# EAGLE design LilypadShield(wPower) (EAGLE 6.4)
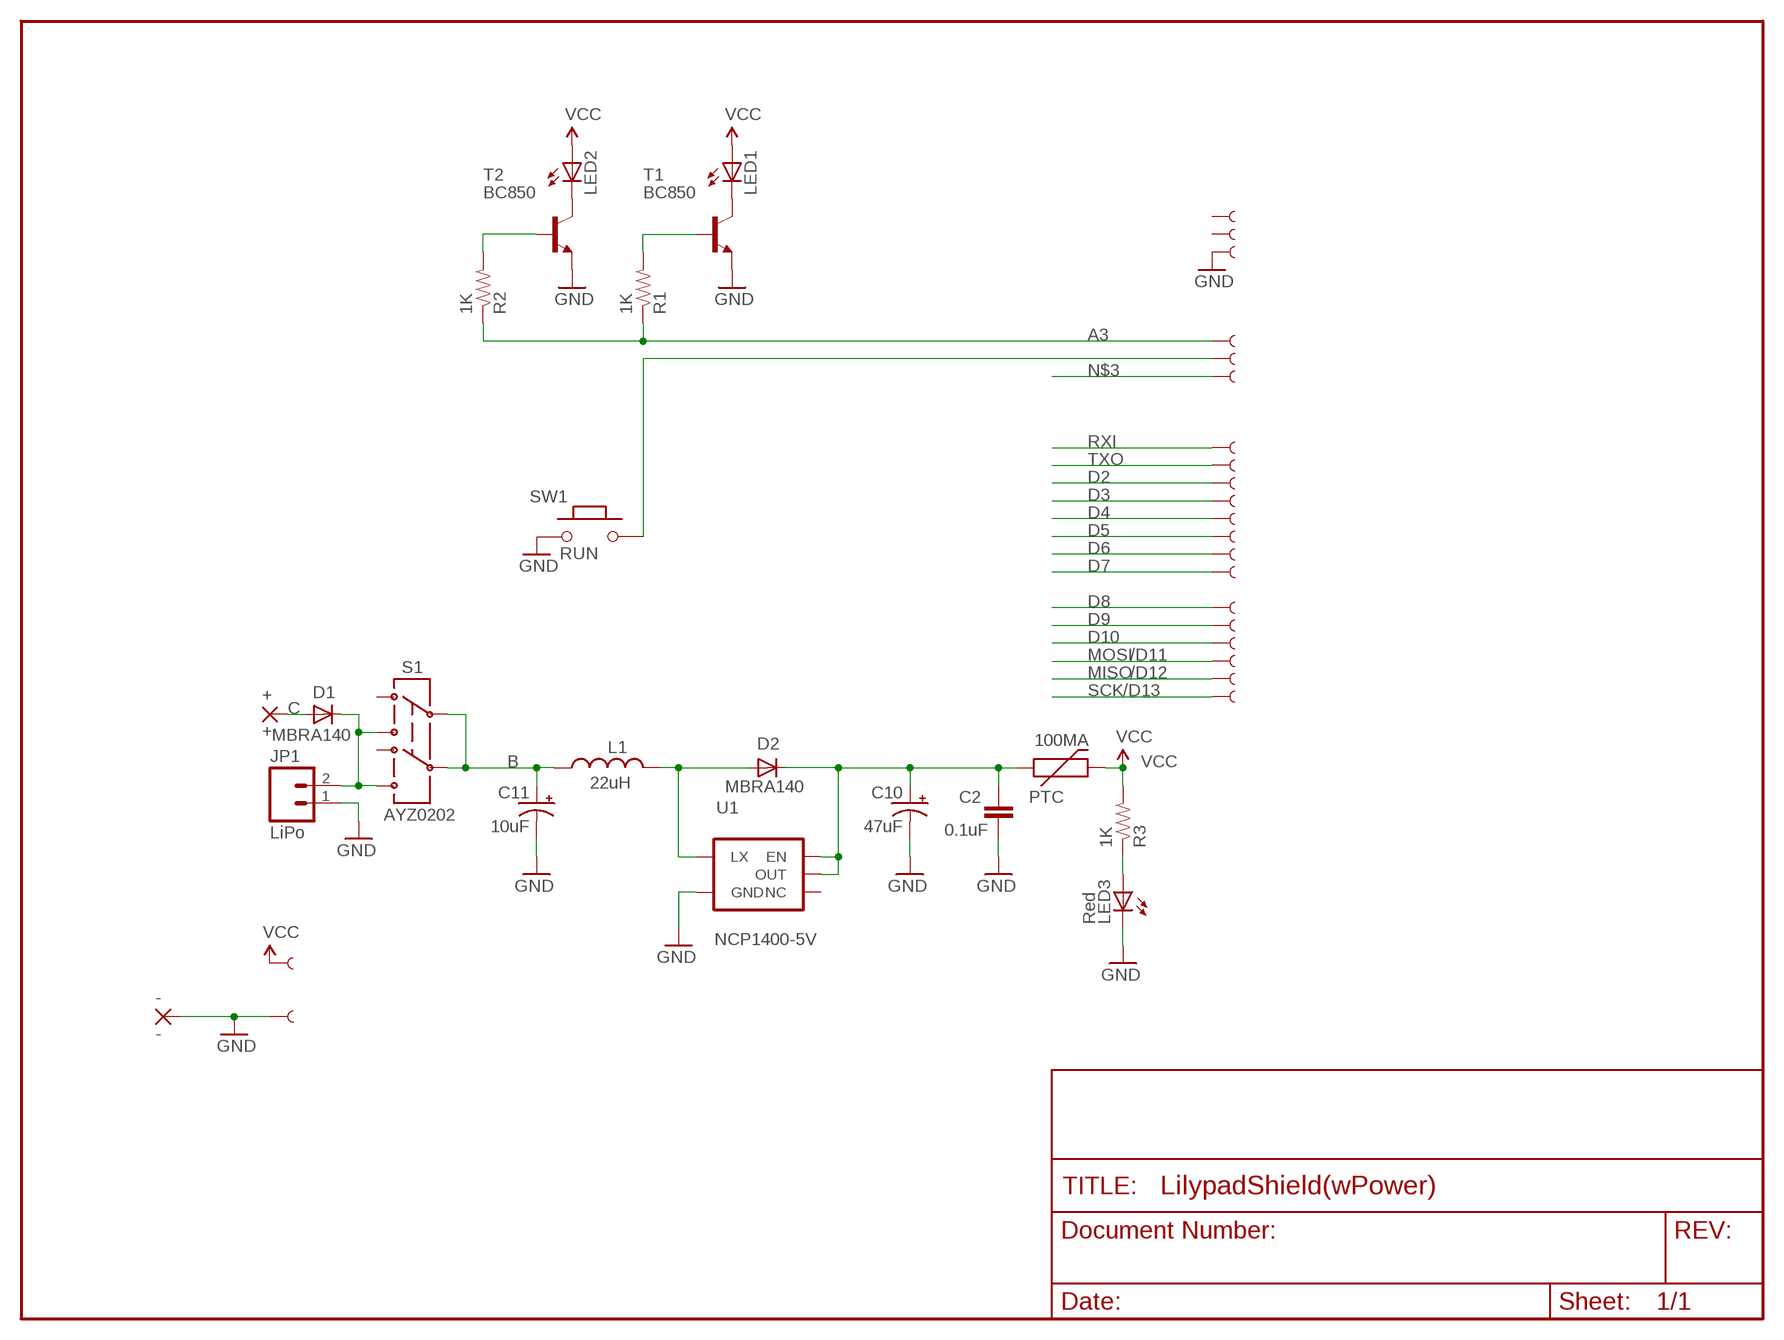
[diagram p0: schematic, sheet 1]

## Parts
100MA  PTC  PTCSMD  [PTC-1206]
+  +  1,6/0,8  [1,6/0,8]
-  -  1,6/0,8  [1,6/0,8]
C2  0.1uF  CAP0603-CAP  [0603-CAP]
C10  47uF  CAP_POL2  [EIA3528-21]
C11  10uF  CAP_POL1206  [CPOL_1206]
D1  MBRA140  DIODESMA  [SMA-DIODE]
D2  MBRA140  DIODESMA  [SMA-DIODE]
GND  SEWTAP1  [SEWTAP]
JP1  LiPo  M02-JST-2MM-SMT  [JST-2-SMD]
L1  22uH  INDUCTORCR54  [CR54]
LED1  LED5MM  [LED5MM]
LED2  LED5MM  [LED5MM]
LED3  Red  LED1206  [LED-1206]
R1  1K  RESISTOR0603-RES  [0603-RES]
R2  1K  RESISTOR0603-RES  [0603-RES]
R3  1K  RESISTOR0603-RES  [0603-RES]
S1  AYZ0202  [AYZ0202]
SW1  RUN  PB157  [157SW]
T1  BC850  [SOT23]
T2  BC850  [SOT23]
U1  NCP1400-5V  V_REG_NCP1400SOT23-5  [SOT23-5]
U$4  SEWTAP1  [SEWTAP]
U$30  SEWTAP1  [SEWTAP]
U$31  SEWTAP1  [SEWTAP]
U$32  SEWTAP1  [SEWTAP]
U$33  SEWTAP1  [SEWTAP]
U$34  SEWTAP1  [SEWTAP]
U$35  SEWTAP1  [SEWTAP]
U$36  SEWTAP1  [SEWTAP]
U$37  SEWTAP1  [SEWTAP]
U$38  SEWTAP1  [SEWTAP]
U$39  SEWTAP1  [SEWTAP]
U$40  SEWTAP1  [SEWTAP]
U$41  SEWTAP1  [SEWTAP]
U$42  SEWTAP1  [SEWTAP]
U$43  SEWTAP1  [SEWTAP]
U$44  SEWTAP1  [SEWTAP]
U$45  SEWTAP1  [SEWTAP]
U$46  SEWTAP1  [SEWTAP]
U$47  SEWTAP1  [SEWTAP]
U$48  SEWTAP1  [SEWTAP]
U$51  SEWTAP1  [SEWTAP]

## Nets
A3: R1.1 R2.1 U$32.1
B: C11.A(+) L1.P$2 S1.2 S1.5
C: +.1(P) D1.A
D2: U$45.1
D3: U$44.1
D4: U$43.1
D5: U$42.1
D6: U$41.1
D7: U$48.1
D8: U$35.1
D9: U$36.1
D10: U$37.1
GND: -.1(P) C2.2 C10.C(-) C11.C(-) JP1.1 LED3.C SW1.1 T1.2(E) T2.2(E) U1.4(GND) U$30.1 U$31.1
MISO: U$39.1
MOSI: U$38.1
N$1: LED2.K(C) T2.3(C)
N$2: LED1.K(C) T1.3(C)
N$3: U$34.1
N$4: R2.2 T2.1(B)
N$5: R1.2 T1.1(B)
N$7: SW1.2 U$33.1
N$9: LED3.A R3.1
N$12: 100MA.1 C2.1 C10.A(+) D2.C U1.1(EN) U1.2(OUT)
N$13: D1.C JP1.2 S1.1 S1.4
N$16: D2.A L1.P$1 U1.5(LX)
RXI: U$47.1
SCK: U$40.1
TXO: U$46.1
VCC: 100MA.2 LED1.A LED2.A R3.2 U$4.1
Unconnected: GND.1 S1.3 S1.6 U1.3(NC) U$51.1

## Notes on the sheet
- /D11
- /D12
- /D13

## Library data of the parts
100MA = SparkFun:PTC: Resettable Fuse PTC Resettable Fuse. Spark Fun Electronics SKU : COM-08357
+ - = wirepad:1,6/0,8: THROUGH-HOLE PAD
C2 = SparkFun:CAP: Capacitor Standard 0603 ceramic capacitor, and 0.1" leaded capacitor.
C10 C11 = SparkFun-Nate:CAP_POL
D1 D2 = SparkFun-Nate:DIODE
GND U$4 U$30-U$48 U$51 = LilyPad-Wearables:SEWTAP
JP1 = SparkFun:M02: Header 2 Standard 2-pin 0.1" header. Use with straight break away headers (SKU : PRT-00116), right angle break away headers (PRT-00553), swiss pins (PRT-00743), machine pins (PRT-00117), and female headers (PRT-00115). Molex polarized connector foot print use with SKU : PRT-08233 with associated crimp pins and housings.
L1 = SparkFun-Nate:INDUCTOR: Basic Inductor/Choke - 0603 and 1206
LED1 LED2 = led:LED: LED OSRAM: - CHIPLED LG R971, LG N971, LY N971, LG Q971, LY Q971, LO R971, LY R971 LH N974, LH R974 LS Q976, LO Q976, LY Q976 LO Q996 - Hyper CHIPLED LW Q18S LB Q993, LB Q99A, LB R99A - SideLED LS A670, LO A670, LY A670, LG A670, LP A670 LB A673, LV A673, LT A673, LW A673 LH A674 LY A675 LS A676, LA A676, LO A676, LY A676, LW A676 LS A679, LY A679, LG A679 - Hyper Micro SIDELED® LS Y876, LA Y876, LO Y876, LY Y876 LT Y87S - SmartLED LW L88C, LW L88S LB L89C, LB L89S, LG L890 LS L89K, LO L89K, LY L89K LS L896, LA L896, LO L896, LY L896 - TOPLED LS T670, LO T670, LY T670, LG T670, LP T670 LSG T670, LSP T670, LSY T670, LOP T670, LYG T670 LG T671, LOG T671, LSG T671 LB T673, LV T673, LT T673, LW T673 LH T674 LS T676, LA T676, LO T676, LY T676, LB T676, LH T676, LSB T676, LW T676 LB T67C, LV T67C, LT T67C, LS T67K, LO T67K, LY T67K, LW E67C LS E67B, LA E67B, LO E67B, LY E67B, LB E67C, LV E67C, LT E67C LW T67C LS T679, LY T679, LG T679 LS T770, LO T770, LY T770, LG T770, LP T770 LB T773, LV T773, LT T773, LW T773 LH T774 LS E675, LA E675, LY E675, LS T675 LS T776, LA T776, LO T776, LY T776, LB T776 LHGB T686 LT T68C, LB T68C - Hyper Mini TOPLED® LB M676 - Mini TOPLED Santana® LG M470 LS M47K, LO M47K, LY M47K Source: http://www.osram.convergy.de LUXEON: - LUMILED® LXK2-PW12-R00, LXK2-PW12-S00, LXK2-PW14-U00, LXK2-PW14-V00 LXK2-PM12-R00, LXK2-PM12-S00, LXK2-PM14-U00 LXK2-PE12-Q00, LXK2-PE12-R00, LXK2-PE12-S00, LXK2-PE14-T00, LXK2-PE14-U00 LXK2-PB12-K00, LXK2-PB12-L00, LXK2-PB12-M00, LXK2-PB14-N00, LXK2-PB14-P00, LXK2-PB14-Q00 LXK2-PR12-L00, LXK2-PR12-M00, LXK2-PR14-Q00, LXK2-PR14-R00 LXK2-PD12-Q00, LXK2-PD12-R00, LXK2-PD12-S00 LXK2-PH12-R00, LXK2-PH12-S00 LXK2-PL12-P00, LXK2-PL12-Q00, LXK2-PL12-R00 Source: www.luxeon.com KINGBRIGHT: KA-3528ASYC Source: www.kingbright.com
LED3 = SparkFun:LED: LEDs Standard schematic elements and footprints for 5mm, 3mm, 1206, and 0603 sized LEDs. 5mm - Spark Fun Electronics SKU : COM-00529 (and others)
R1-R3 = SparkFun:RESISTOR: Resistor Basic schematic elements and footprints for 0603, 1206, and PTH resistors.
S1 = SparkFun:AYZ0202: SPDT Slide Switch Simple SMD single-pull double-throw slide switch. Good for less than 350mA power switch, switching UARTs between devices, etc. Spark Fun Electronics SKU : COM-00597
SW1 = MySMD:PB157
T1 T2 = transistor-neu-to92:BC850: NPN TRANSISTOR
U1 = SparkFun:V_REG_NCP1400: Switching step-up voltage regulator NCP1400 switiching regulator takes single cell AA and outputs 100mA at 3.3V or 5V with minimal number of external components.

## Net classes
0 Default: width 0.203 mm, clearance 0.355 mm
1 VCC: width 0.305 mm, clearance 0.355 mm

## Board
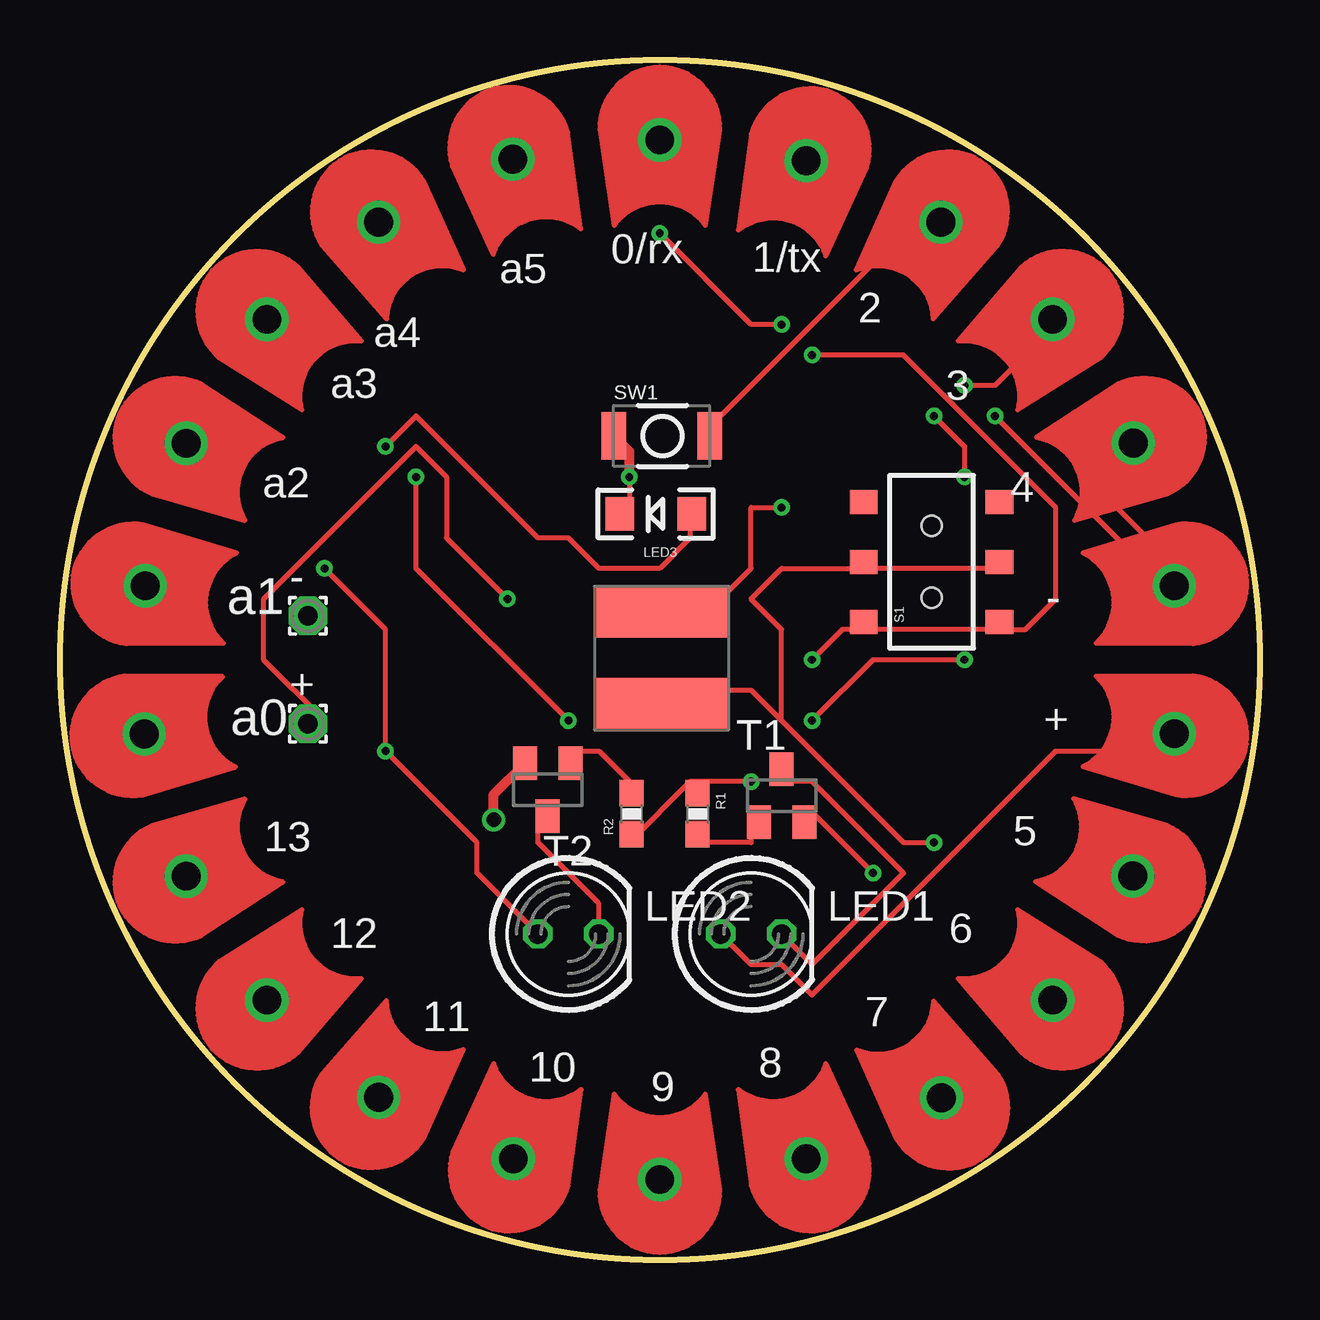
[diagram p1: board, top side]
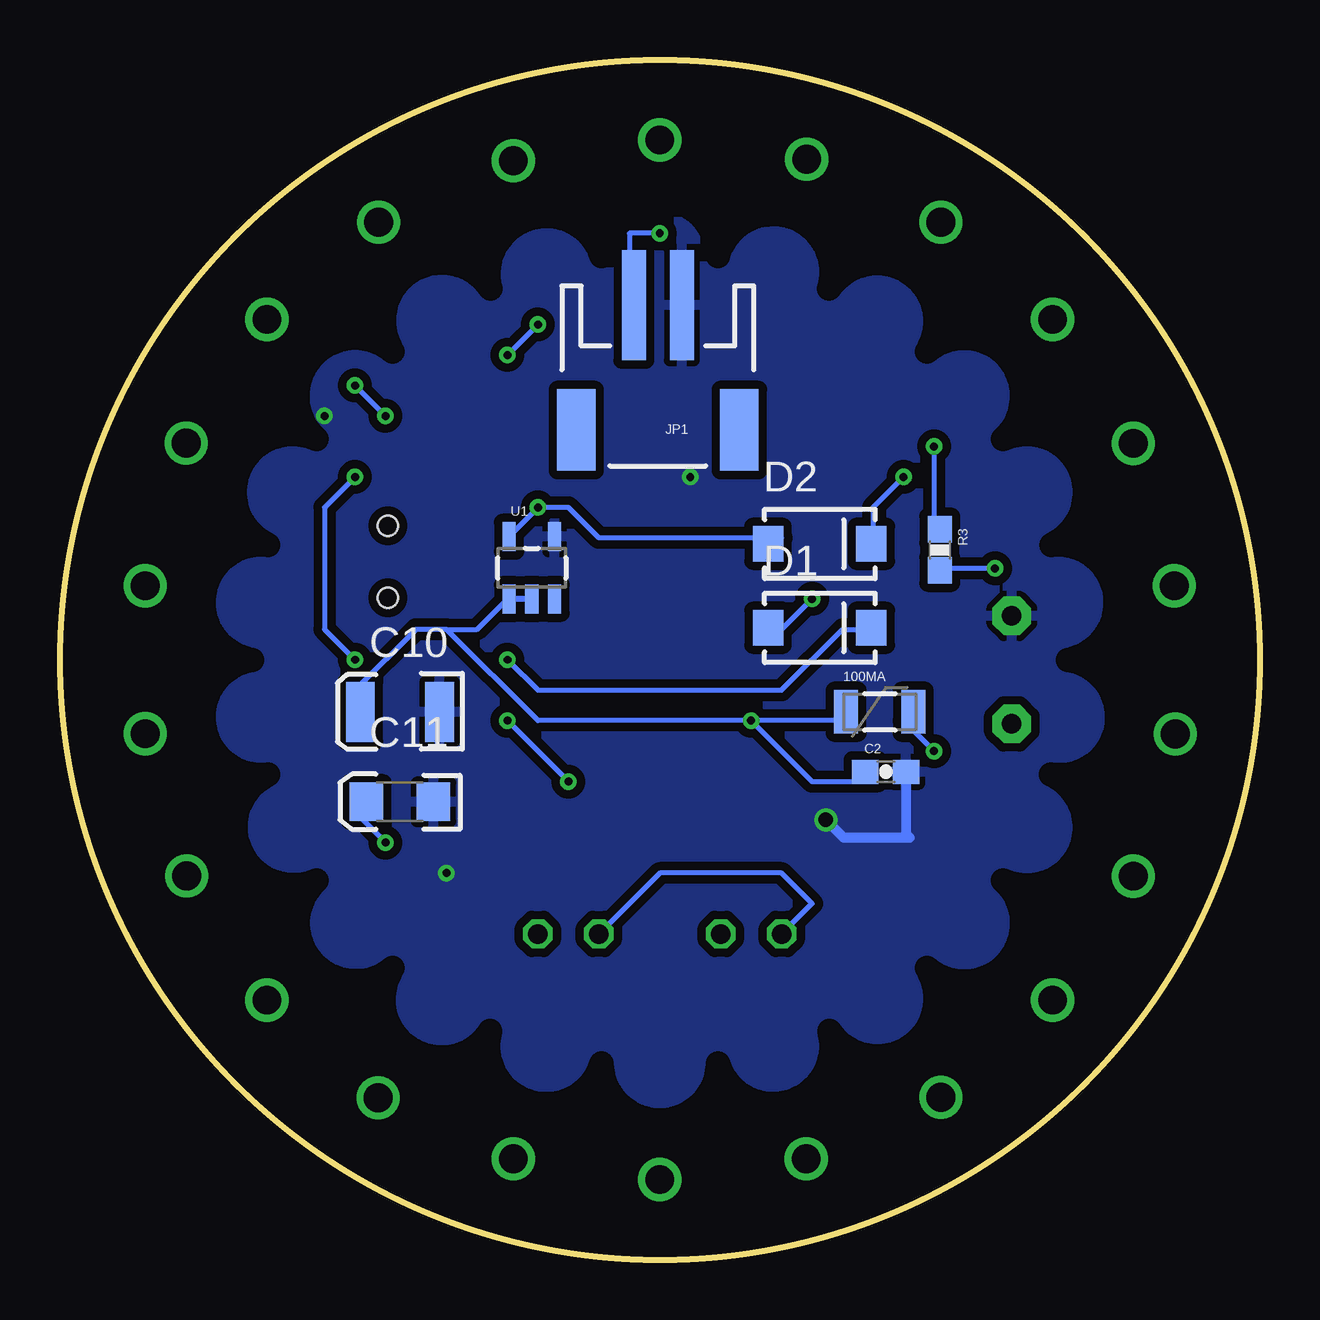
[diagram p2: board, bottom side, seen from below]

Size 50 x 50 mm. Coordinates in mm from the lower left corner, seen from the top.
Outline: circle at 25,25 radius 25
Copper layers (1*16): Top 0.0356mm / dielectric 1.5011mm / Bottom 0.0356mm
Design rules "LaenPCBOrder": minimum track width 6mil, minimum drill 13mil, track to track 6mil, track to pad 6mil, pad to pad 6mil, via to via 6mil, smd to smd 6mil, copper to edge 15mil, drill to drill 6mil, minimum pad ring 7mil, minimum via ring 7mil, stop-mask expansion 3mil, vias tented up to drill 0mil, thermal gap 10mil
bRestrict: area 2.4,2.4 to 47.6,47.6; area 21,42.8 to 23.5,44; area 31.6,41.3 to 34.4,43; area 36.3,38.4 to 38.9,40.7; area 40,34.1 to 42,36.9; area 42.2,29.2 to 43.6,31.8; area 42.8,23.9 to 44,26.2; area 42.2,18.2 to 43.7,20.9; area 36.3,9.4 to 39,11.7; area 31.7,7 to 34.5,8.7; area 26.5,6 to 28.9,7.3; area 21.1,6 to 23.6,7.3; area 15.6,7 to 18.3,8.7; area 11,9.3 to 13.8,11.6; area 8,13.1 to 10.1,15.9; area 6.4,18.2 to 8,20.8; area 6,23.7 to 7.2,26.2; area 6.3,29.1 to 7.9,31.7; area 8,34 to 10.1,36.9; area 11,38.3 to 13.7,40.6; area 15.4,41.2 to 18.4,43; area 26.4,42.5 to 29.1,44; area 40,13 to 42,16.1; 22 lines

### Footprints (pad centres in the part's own frame; a part is rotated, then mirrored left to right if it is on the bottom)
PTC-1206 = smd 1 x 1.8: 1 -1.4,0; 2 1.4,0
1,6/0,8 = drill 0.813 pad 1.6 octagon: 1 0,0
0603-CAP = smd 1.1 x 1: 1 -0.85,0; 2 0.85,0
EIA3528-21 = smd 2.5 x 1.2: A 0,-1.65; C 0,1.65
CPOL_1206 = smd 1.6 x 1.4: A 0,-1.4; C 0,1.4
SMA-DIODE = smd 1.27 x 1.47: A -2.15,0; C 2.15,0
SEWTAP = drill 1.2: 1 0.03,0
JST-2-SMD = smd 1 x 4.6: 1 -1,-3.7; 2 1,-3.7 | smd 1.6 x 3.4: NC1 -3.4,1.5; NC2 3.4,1.5
CR54 = smd 5.5 x 2.15: P$1 0,1.92; P$2 0,-1.92
LED5MM = drill 0.813 octagon: A -1.27,0; K 1.27,0
LED-1206 = smd 1.2 x 1.4: A -1.5,0; C 1.5,0
0603-RES = smd 1.1 x 1: 1 -0.85,0; 2 0.85,0
AYZ0202 = smd 1 x 1.15: 1 -2.5,2.825; 2 0,2.825; 3 2.5,2.825; 4 -2.5,-2.825; 5 0,-2.825; 6 2.5,-2.825 | hole 0.85: 1.5,0; -1.5,0
157SW = smd 1.016 x 1.981: 1 0,0; 2 4,0
SOT23 = smd 1 x 1.4: 1 -0.95,-1.1; 2 0.95,-1.1; 3 0,1.1
SOT23-5 = smd 0.55 x 1.2: 1 -0.95,-1.3; 2 0,-1.3; 3 0.95,-1.3; 4 0.95,1.3; 5 -0.95,1.3

### Placement (x,y rotation side)
100MA  15.83,22.83 0 bottom
+  10.33,22.33 0 top
-  10.33,26.83 0 top
C2  15.58,20.33 0 bottom
C10  35.83,22.83 270 bottom
C11  35.83,19.08 270 bottom
D1  18.33,26.33 0 bottom
D2  18.33,29.83 0 bottom
GND  3.52,28.09 351.8 top
JP1  25.08,36.08 180 bottom
L1  25.08,25.08 0 top
LED1  28.81,13.57 0 top
LED2  21.19,13.57 0 top
LED3  24.83,31.08 180 top
R1  26.58,18.58 270 top
R2  23.83,18.58 90 top
R3  13.33,29.58 270 bottom
S1  36.33,29.08 90 top
SW1  23.08,34.33 0 top
T1  30.08,19.33 0 top
T2  20.33,19.58 180 top
U1  30.33,28.83 0 bottom
U$4  46.48,21.91 171.8 top
U$30  46.48,28.09 188.2 top
U$31  44.77,34.04 204.5 top
U$32  41.4,39.21 220.9 top
U$33  36.74,43.26 237.3 top
U$34  31.11,45.83 253.7 top
U$35  18.89,4.17 73.7 top
U$36  25,3.3 90 top
U$37  31.11,4.17 106.3 top
U$38  36.76,6.72 122.7 top
U$39  41.4,10.79 139.1 top
U$40  44.74,15.98 155.5 top
U$41  8.6,10.79 40.9 top
U$42  5.23,15.97 24.5 top
U$43  5.23,34.03 335.5 top
U$44  8.6,39.21 319.1 top
U$45  13.27,43.26 302.7 top
U$46  18.87,45.89 286.3 top
U$47  25,46.7 270 top
U$48  13.26,6.74 57.3 top
U$51  3.48,21.9 8.2 top

### Tracks (layer width: path | path; a pad name or v marks a point on that pad's centre or on a via)
A3  (via drill 0.33)
  Top 0.203: 26.27,19.92 23.73,17.38 R2.1 | v28.81,19.92 26.27,19.92 | v31.35,22.46 33.89,25 v37.7,25 | v37.7,32.62 37.7,33.89 v36.43,35.16 | v37.7,36.43 38.97,36.43 41.51,38.97 U$32.1 | 26.27,19.92 R1.1
  Bottom 0.203: v31.35,22.46 v28.81,19.92 | v37.7,25 38.97,26.27 38.97,31.35 v37.7,32.62 | v37.7,36.43 v36.43,35.16
B  (via drill 0.33)
  Top 0.203: 33.89,28.81 38.97,28.81 S1.5 | v36.43,17.38 35.16,17.38 30.08,22.46 | 30.08,22.46 28.81,23.73 26.27,23.73 L1.P$2 | 33.89,28.81 30.08,28.81 28.81,27.54 30.08,26.27 30.08,22.46 | 33.89,28.81 S1.2
  Bottom 0.203: v36.43,17.38 37.7,18.65 C11.A
C  (via drill 0.33)
  Top 0.203: v18.65,27.54 16.11,30.08 16.11,32.62 14.84,33.89 8.49,27.54 8.49,25 11.03,22.46 +.1
  Bottom 0.203: v18.65,27.54 19.92,26.27 D1.A
GND  (via drill 0.33, 0.6)
  Top 0.203: v33.89,16.11 31.35,18.65 T1.2 | v38.97,35.16 46.59,27.54 U$30.1 46.59,28.81 44.05,31.35 44.05,33.89 U$31.1 | v23.73,32.62 23.73,31.35 LED3.C
  Top 0.406: v23.73,32.62 23.73,33.68 SW1.1 | v18.08,18.33 18.08,19.38 T2.2
  Bottom 0.406: C2.2 14.73,17.73 14.58,17.58 17.33,17.58 v18.08,18.33
  pour Bottom (isolate 0.305): -1,51 51,51 51,-1 -1,-1
N$1
  Top 0.203: LED2.K 22.46,14.84 19.92,17.38 19.92,18.65 T2.3
N$2
  Top 0.203: LED1.K 31.35,12.3 35.16,16.11 31.35,19.92 30.08,19.92 T1.3
N$4
  Top 0.203: R2.2 23.73,19.92 22.46,21.19 21.19,21.19 T2.1
N$5
  Top 0.203: R1.2 26.27,17.38 28.81,17.38 28.81,18.65 T1.1
N$6
  Top 0.406: 36.83,43.08 36.33,40.08
N$7
  Top 0.203: SW1.2 27.54,35.16 36.43,44.05 U$33.1
N$9  (via drill 0.33)
  Top 0.203: v13.57,33.89 14.84,35.16 19.92,30.08 21.19,30.08 22.46,28.81 25,28.81 26.27,30.08 26.27,31.35 LED3.A
  Bottom 0.203: v13.57,33.89 13.57,30.08 R3.1
N$12  (via drill 0.33)
  Top 0.203: v14.84,32.62 14.84,28.81 v21.19,22.46
  Bottom 0.203: 33.89,26.27 35.16,26.27 37.7,23.73 C10.A | 33.89,26.27 30.08,22.46 v21.19,22.46 | v21.19,22.46 17.38,22.46 100MA.1 | v21.19,22.46 18.65,19.92 16.11,19.92 C2.1 | 33.89,26.27 32.62,26.27 31.35,27.54 U1.1 | v14.84,32.62 16.11,31.35 16.11,30.08 D2.C
  Bottom 0.254: U1.2 U1.1
N$13  (via drill 0.33)
  Top 0.203: 38.97,26.27 33.89,26.27 | v31.35,25 32.62,26.27 33.89,26.27 | 33.89,26.27 S1.1 | v25,42.78 28.81,38.97 v30.08,38.97 | v31.35,37.7 35.16,37.7 41.51,31.35 41.51,27.54 40.24,26.27 38.97,26.27 | 38.97,26.27 S1.4
  Bottom 0.203: v31.35,25 30.08,23.73 19.92,23.73 17.38,26.27 16.11,26.27 D1.C | v25,42.78 26.27,42.78 26.27,40.24 JP1.2 | v31.35,37.7 v30.08,38.97
N$16  (via drill 0.33)
  Top 0.203: v30.08,31.35 28.81,31.35 28.81,28.81 27.54,27.54 26.27,27.54 L1.P$1
  Bottom 0.203: U1.5 31.35,30.08 v30.08,31.35 28.81,31.35 27.54,30.08 19.92,30.08 D2.A
VCC  (via drill 0.33)
  Top 0.203: v11.03,28.81 13.57,26.27 v13.57,21.19 17.38,17.38 17.38,16.11 LED2.A | LED1.A 28.81,12.3 30.08,12.3 31.35,11.03 41.51,21.19 46.59,21.19 U$4.1
  Bottom 0.203: v11.03,28.81 13.57,28.81 R3.2 | v13.57,21.19 14.84,22.46 100MA.2 | LED1.A 25,16.11 19.92,16.11 18.65,14.84 LED2.A

### Text on the board
tPlace: 0/rx | 1/tx | a5 | a4 | 2 | a3 | 3 | a2 | 4 | a1 | - | a0 | + | 13 | 5 | 12 | 6 | 11 | 7 | 10 | 8 | 9